# EAGLE design GONAKED (EAGLE 5.11)
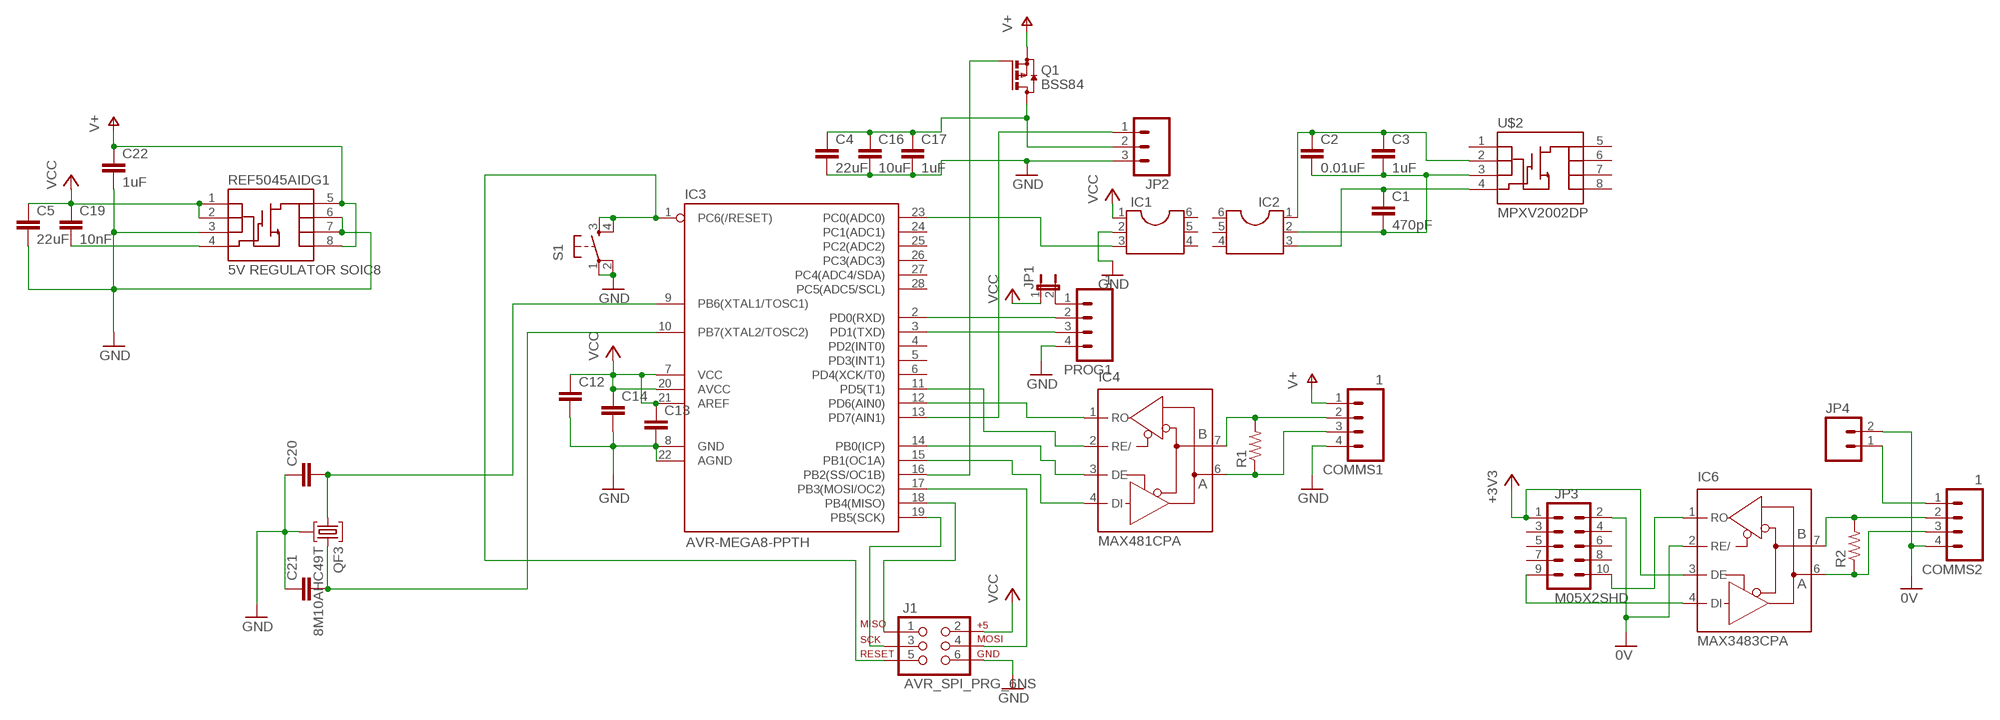
[diagram p0: schematic, sheet 1]

## Parts
C1  470pF  CAP0805  [0805]
C2  0.01uF  CAP0805  [0805]
C3  1uF  CAP0805  [0805]
C4  22uF  CAP1210  [1210]
C5  22uF  CAP1210  [1210]
C12  CAP0805  [0805]
C13  CAP0805  [0805]
C14  CAP0805  [0805]
C16  10uF  CAP0805  [0805]
C17  1uF  CAP0805  [0805]
C19  10nF  CAP0805  [0805]
C20  CAP0805  [0805]
C21  CAP0805  [0805]
C22  1uF  CAP0805  [0805]
COMMS1  1  M04POLAR  [MOLEX-1X4]
COMMS2  1  M04POLAR  [MOLEX-1X4]
IC1  DIL6  [DIL06]
IC2  DIL6  [DIL06]
IC3  AVR-MEGA8-PPTH  [DIL28-3]
IC4  MAX481CPA  [DIL08]
IC6  MAX3483CPA  [DIL08]
J1  AVR_SPI_PRG_6NS  [2X3-NS]
JP1  JUMPER-2PTH  [1X02]
JP2  M03POLAR  [MOLEX-1X3]
JP3  M05X2SHD  [2X5-SHROUDED]
JP4  M02LOCK_LONGPADS  [1X02_LOCK_LONGPADS]
PROG1  1  M04POLAR  [MOLEX-1X4]
Q1  BSS84  [SOT23]
QF3  8M10AHC49T  [HC49U]
R1  RESISTOR0805-RES  [0805]
R2  RESISTOR0805-RES  [0805]
REF5045AIDG1  5V REGULATOR SOIC8  MOSFET-NCHANNEL-SOIC8  [SO08]
S1  TAC_SWITCHPTH  [TACTILE-PTH]
U$2  MPXV2002DP  MOSFET-NCHANNEL-SOIC8  [SO08]

## Nets
0V: COMMS2.4 IC6.2(RE/) JP3.2 JP4.2
+3V3: IC6.3(DE) JP3.1
GND: C4.2 C5.2 C12.2 C13.2 C14.2 C16.2 C17.2 C20.1 C21.1 C22.2 COMMS1.4 IC1.2 IC3.8(GND) IC3.22(AGND) J1.6 JP2.3 PROG1.4 QF3.2 REF5045AIDG1.3(S) REF5045AIDG1.6(D) REF5045AIDG1.7(D) S1.1 S1.2
N$1: C4.1 C16.1 C17.1 JP2.2 Q1.3(D)
N$2: IC3.19(PB5(SCK)) J1.3
N$3: IC3.1(PC6(/RESET)) J1.5 S1.3 S1.4
N$4: IC1.3 IC3.23(PC0(ADC0))
N$5: IC3.18(PB4(MISO)) J1.1
N$6: IC3.17(PB3(MOSI/OC2)) J1.4
N$7: IC3.13(PD7(AIN1)) JP2.1
N$8: COMMS1.2 IC4.7(B) R1.2
N$9: COMMS1.3 IC4.6(A) R1.1
N$10: IC3.2(PD0(RXD)) PROG1.2
N$11: IC3.3(PD1(TXD)) PROG1.3
N$12: IC3.12(PD6(AIN0)) IC4.1(RO)
N$13: IC3.11(PD5(T1)) IC4.2(RE/)
N$14: IC3.14(PB0(ICP)) IC4.3(DE)
N$15: IC3.15(PB1(OC1A)) IC4.4(DI)
N$16: JP1.2 PROG1.1
N$17: C20.2 IC3.9(PB6(XTAL1/TOSC1)) QF3.1
N$18: C21.2 IC3.10(PB7(XTAL2/TOSC2)) QF3.3
N$19: IC3.16(PB2(SS/OC1B)) Q1.1(G)
N$20: COMMS2.2 IC6.7(B) R2.2
N$21: COMMS2.3 IC6.6(A) R2.1
N$23: C19.2 REF5045AIDG1.4(G)
N$24: IC6.1(RO) JP3.10
N$25: IC6.4(DI) JP3.9
N$27: COMMS2.1 JP4.1
N$31: C1.1 IC2.3 U$2.4(G)
N$32: C2.1 C3.1 IC2.1 U$2.2(S)
N$34: C1.2 C2.2 C3.2 IC2.2 U$2.3(S)
V+: C22.1 COMMS1.1 Q1.2(S) REF5045AIDG1.5(D) REF5045AIDG1.8(D)
VCC: C5.1 C12.1 C13.1 C14.1 C19.1 IC1.1 IC3.7(VCC) IC3.20(AVCC) IC3.21(AREF) J1.2 JP1.1 REF5045AIDG1.1(S) REF5045AIDG1.2(S)
Unconnected: IC1.4 IC1.5 IC1.6 IC2.4 IC2.5 IC2.6 IC3.4(PD2(INT0)) IC3.5(PD3(INT1)) IC3.6(PD4(XCK/T0)) IC3.24(PC1(ADC1)) IC3.25(PC2(ADC2)) IC3.26(PC3(ADC3)) IC3.27(PC4(ADC4/SDA)) IC3.28(PC5(ADC5/SCL)) JP3.3 JP3.4 JP3.5 JP3.6 JP3.7 JP3.8 U$2.1(S) U$2.5(D) U$2.6(D) U$2.7(D) U$2.8(D)

## Power pins joined to a net without a drawn wire
0V: IC6.5(0V)
+3V3: IC6.8(+3V3)
GND: IC4.5(GND)
VCC: IC4.8(VCC)

## Library data of the parts
C1-C5 C12-C14 C16 C17 C19-C22 = SparkFun:CAP: Capacitor Standard 0603 ceramic capacitor, and 0.1" leaded capacitor.
COMMS1 COMMS2 PROG1 = SparkFun:M04: Header 4 Standard 4-pin 0.1" header. Use with straight break away headers (SKU : PRT-00116), right angle break away headers (PRT-00553), swiss pins (PRT-00743), machine pins (PRT-00117), and female headers (PRT-00115). Molex polarized connector foot print use with SKU : PRT-08231 with associated crimp pins and housings. 1MM SMD Version SKU: PRT-10208
IC1 IC2 = ic-package:DIL6: Dual In Line / Socket
IC3 = SparkFun:AVR-MEGA8-P: MICROCONTROLLER 8 Kbytes FLASH 1 kbytes SRAM 512 bytes EEPROM USART 4-channel 10 bit ADC 2-channel 8 bit ADC
IC4 = maxim:MAX481CPA: RS485 TRANSEIVER; MPN: MAX481CPA+; OC_FARNELL: unknown; OC_NEWARK: 99K3445
IC6 = maxim-10:MAX3483CPA: RS485 TRANSEIVER
J1 = SparkFun:AVR_SPI_PRG_6: AVR ISP 6 Pin This is the reduced ISP connector for AVR programming. Common on Arduino. This footprint will take up less PCB space and can be used with a 10-pin to 6-pin adapter such as SKU: BOB-08508
JP1 = SparkFun:JUMPER-2: Jumper Basic 0.1" spaced jumper. Use with breakaway headers.
JP2 = SparkFun:M03: Header 3 Standard 3-pin 0.1" header. Use with straight break away headers (SKU : PRT-00116), right angle break away headers (PRT-00553), swiss pins (PRT-00743), machine pins (PRT-00117), and female headers (PRT-00115). Molex polarized connector foot print use with SKU : PRT-08232 with associated crimp pins and housings.
JP3 = SparkFun:M05X2: Header 5x2 Standard 10-pin dual row 0.1" header. Commonly used with AVR-ISP. Use with Spark Fun Electronics SKU: PRT-00778
JP4 = SparkFun:M02: Header 2 Standard 2-pin 0.1" header. Use with straight break away headers (SKU : PRT-00116), right angle break away headers (PRT-00553), swiss pins (PRT-00743), machine pins (PRT-00117), and female headers (PRT-00115). Molex polarized connector foot print use with SKU : PRT-08233 with associated crimp pins and housings.
Q1 = transistor-small-signal:BSS84: P-CHANNEL MOS FET
QF3 = crystal:8M10AHC49T: Monolithic Crystal Filters Source: www.vanlong.com; OC_FARNELL: unknown; OC_NEWARK: unknown
R1 R2 = SparkFun:RESISTOR: Resistor Basic schematic elements and footprints for 0603, 1206, and PTH resistors.
REF5045AIDG1 U$2 = SparkFun:MOSFET-NCHANNEL-SOIC8: N-Channel MOSFET IRF9410 and NDS8434 are common, SOIC-8 parts.
S1 = SparkFun:TAC_SWITCH: Momentary Switch Button commonly used for reset or general input. Spark Fun Electronics SKU : COM-00097

## Board
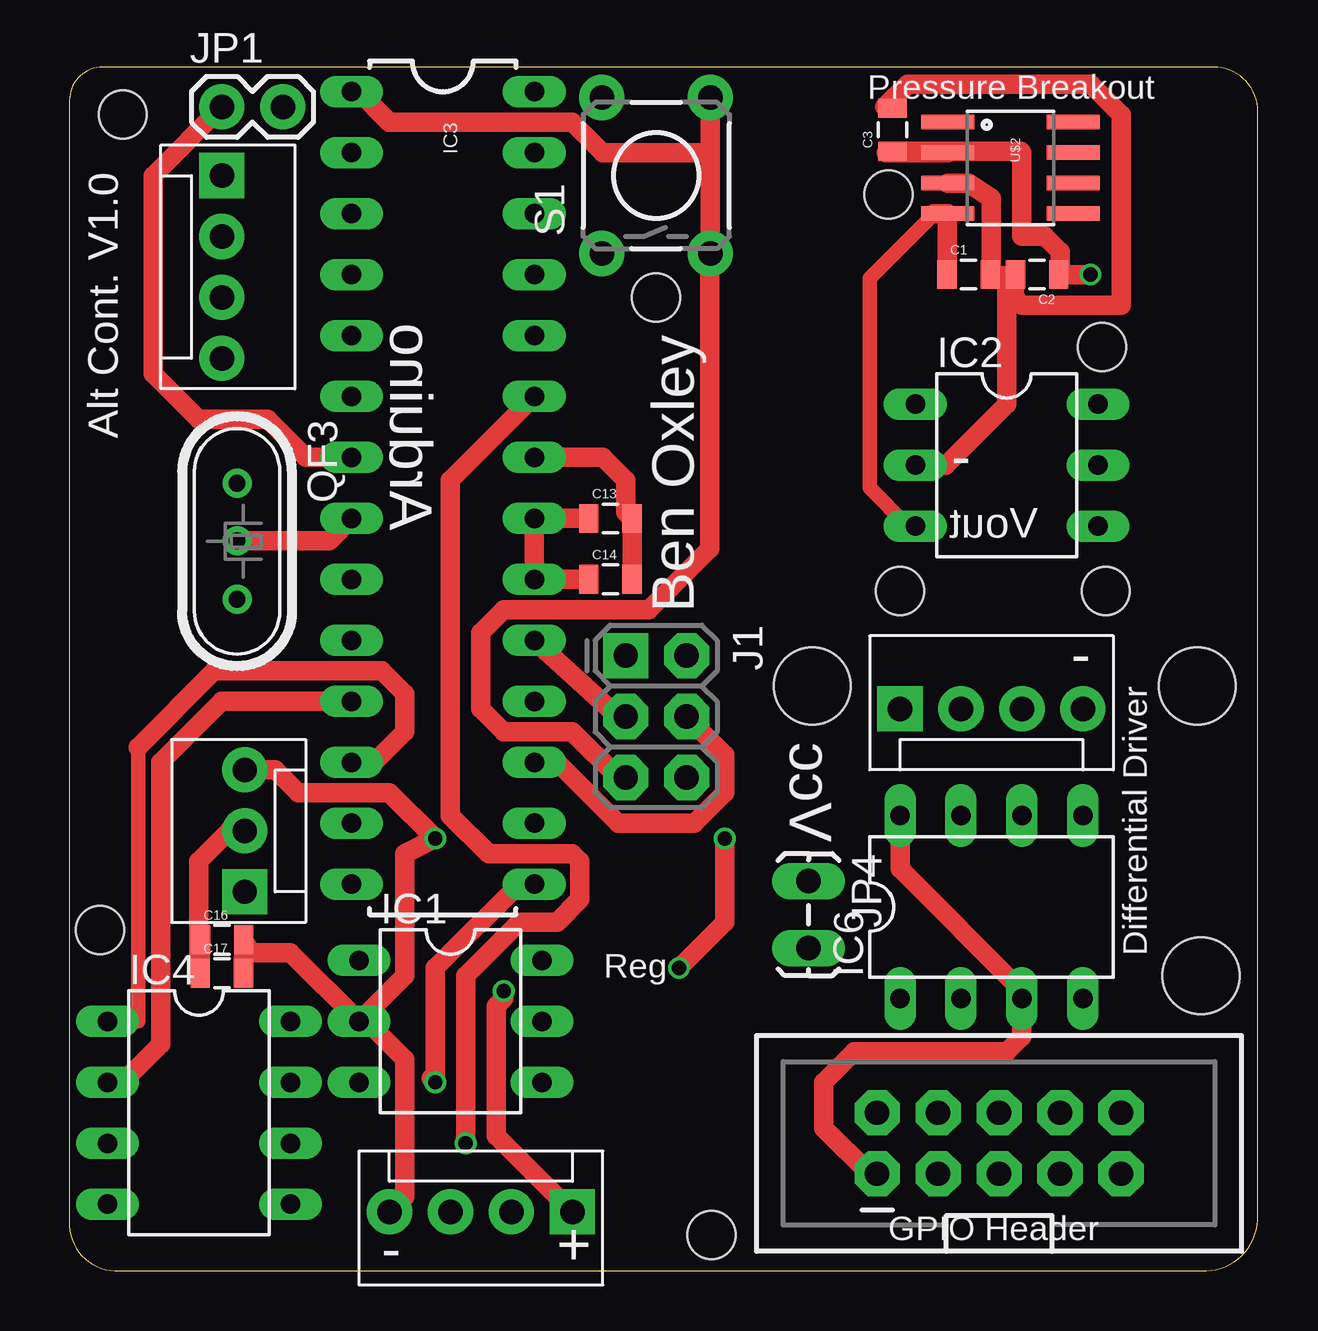
[diagram p1: board, top side]
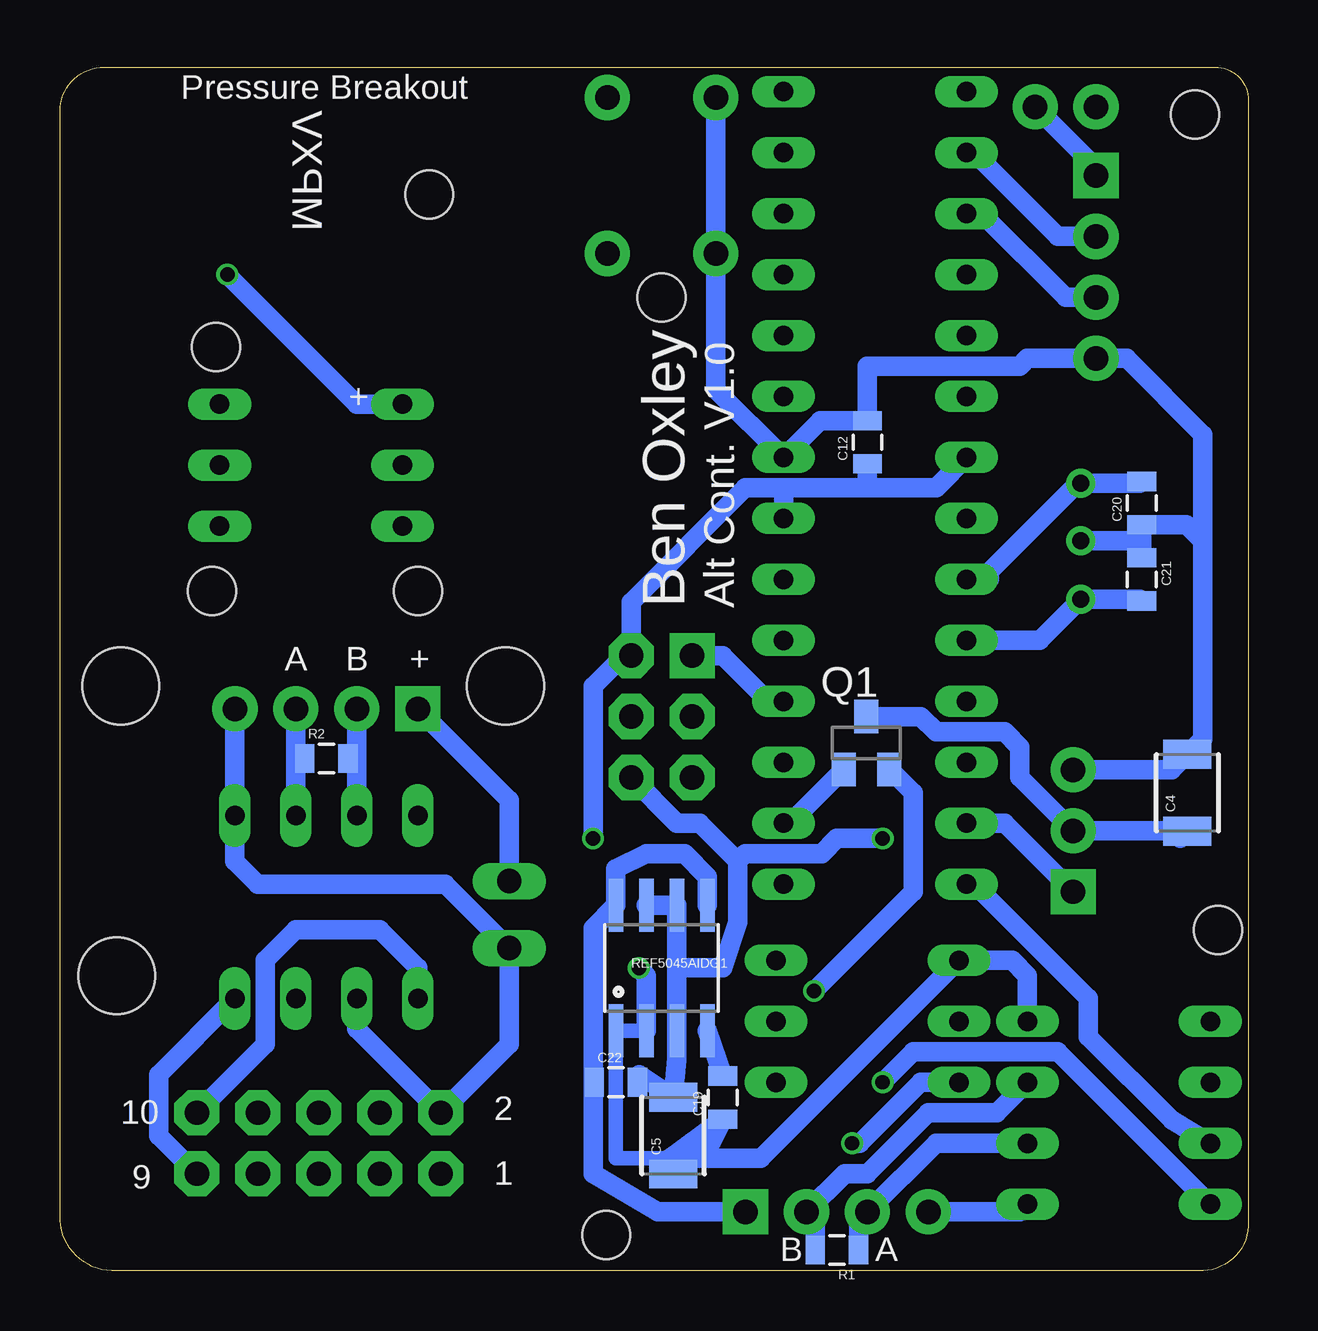
[diagram p2: board, bottom side, seen from below]

Size 49.52 x 50.16 mm. Coordinates in mm from the lower left corner, seen from the top.
Outline: 1.38,50.16 arc90 0,48.78 0,2.05 arc90 1.89,0 47.36,0 arc90 49.52,2.31 49.52,48.32 arc90 47.68,50.16 1.38,50.16
Copper layers (1*16): Top 0.035mm / dielectric 1.5mm / Bottom 0.035mm
Design rules "Fusion_eagle_rule_v1.1": minimum track width 6mil, minimum drill 12mil, track to track 6mil, track to pad 6mil, pad to pad 6mil, via to via 6mil, smd to smd 0mil, copper to edge 10mil, drill to drill 10mil, minimum pad ring 10mil, minimum via ring 6mil, stop-mask expansion 2mil, vias tented up to drill 100mil, thermal gap 10mil
Holes 2 mm at 26.76,1.49 2.22,48.18 24.45,40.56 1.27,14.21 34.61,28.33 43.18,28.33 34.13,44.84 43.02,38.49
Holes 3.2 mm at 30.96,24.37 46.99,24.37 47.15,12.3

### Footprints (pad centres in the part's own frame; a part is rotated, then mirrored left to right if it is on the bottom)
0805 = smd 0.8 x 1.2: 1 -0.9,0; 2 0.9,0
1210 = smd 1.2 x 2: 1 -1.6,0; 2 1.6,0
MOLEX-1X4 = drill 1.016 pad 1.88 square: 1 0,0 | drill 1.016 pad 1.88 round: 2 2.54,0; 3 5.08,0; 4 7.62,0
DIL06 = drill 0.813 long: 1 -2.54,-3.81; 2 0,-3.81; 3 2.54,-3.81; 4 2.54,3.81; 5 0,3.81; 6 -2.54,3.81
DIL28-3 = drill 0.813 long: 1 -16.51,-3.81; 2 -13.97,-3.81; 3 -11.43,-3.81; 4 -8.89,-3.81; 5 -6.35,-3.81; 6 -3.81,-3.81; 7 -1.27,-3.81; 8 1.27,-3.81; 9 3.81,-3.81; 10 6.35,-3.81; 11 8.89,-3.81; 12 11.43,-3.81; 13 13.97,-3.81; 14 16.51,-3.81; 15 16.51,3.81; 16 13.97,3.81; 17 11.43,3.81; 18 8.89,3.81; 19 6.35,3.81; 20 3.81,3.81; 21 1.27,3.81; 22 -1.27,3.81; 23 -3.81,3.81; 24 -6.35,3.81; 25 -8.89,3.81; 26 -11.43,3.81; 27 -13.97,3.81; 28 -16.51,3.81
DIL08 = drill 0.813 long: 1 -3.81,-3.81; 2 -1.27,-3.81; 3 1.27,-3.81; 4 3.81,-3.81; 5 3.81,3.81; 6 1.27,3.81; 7 -1.27,3.81; 8 -3.81,3.81
2X3-NS = drill 1.016 pad 1.88 square: 1 -2.54,-1.27 | drill 1.016 pad 1.88 octagon: 2 -2.54,1.27; 3 0,-1.27; 4 0,1.27; 5 2.54,-1.27; 6 2.54,1.27
1X02 = drill 1.016 pad 1.88 round: 1 0,0; 2 2.54,0
MOLEX-1X3 = drill 1.016 pad 1.88 square: 1 0,0 | drill 1.016 pad 1.88 round: 2 2.54,0; 3 5.08,0
2X5-SHROUDED = drill 1.016 pad 1.88 octagon: 1 -1.27,5.08; 2 1.27,5.08; 3 -1.27,2.54; 4 1.27,2.54; 5 -1.27,0; 6 1.27,0; 7 -1.27,-2.54; 8 1.27,-2.54; 9 -1.27,-5.08; 10 1.27,-5.08
1X02_LOCK_LONGPADS = drill 1.016 long: 1 -0.127,0; 2 2.667,0
SOT23 = smd 1 x 1.4: 1 -0.95,-1.1; 2 0.95,-1.1; 3 0,1.1
HC49U = drill 0.7 pad 1.2 round: 1 -2.413,0; 2 -0.027,0; 3 2.413,0
SO08 = smd 0.61 x 2.21: 1 -1.905,-2.616; 2 -0.635,-2.616; 3 0.635,-2.616; 4 1.905,-2.616; 5 1.905,2.616; 6 0.635,2.616; 7 -0.635,2.616; 8 -1.905,2.616
TACTILE-PTH = drill 1.016 pad 1.88 round: 1 -3.251,2.261; 2 3.251,2.261; 3 -3.251,-2.261; 4 3.251,-2.261

### Placement (x,y rotation side)
C1  37.47,41.51 0 top
C2  40.32,41.51 180 top
C3  34.29,47.54 90 top
C4  2.54,19.92 90 bottom
C5  23.97,5.63 90 bottom
C12  15.87,34.53 90 bottom
C13  22.54,31.35 0 top
C14  22.54,28.81 0 top
C16  6.36,13.79 0 top
C17  6.35,12.4 0 top
C19  21.91,7.22 90 bottom
C20  4.45,31.99 90 bottom
C21  4.45,28.81 270 bottom
C22  26.35,7.86 0 bottom
COMMS1  20.95,2.46 180 top
COMMS2  34.61,23.41 0 top
IC1  15.87,10.4 270 top
IC2  39.05,33.57 270 top
IC3  15.56,32.62 270 top
IC4  5.4,6.59 270 top
IC6  38.42,15.16 0 top
J1  24.45,23.1 270 top
JP1  6.35,48.5 0 top
JP2  7.3,15.79 90 top
JP3  38.73,5.32 90 top
JP4  30.8,16.11 270 top
PROG1  6.35,45.64 270 top
Q1  15.92,22 0 bottom
QF3  6.98,30.4 270 top
R1  17.15,0.87 180 bottom
R2  38.42,21.35 0 bottom
REF5045AIDG1  24.45,12.62 0 bottom
S1  24.45,45.64 90 top
U$2  39.21,45.96 270 top

### Tracks (layer width: path | path; a pad name or v marks a point on that pad's centre or on a via)
0V
  Bottom 0.813: COMMS2.4 IC6.5 42.23,17.06 41.27,16.11 33.46,16.11 JP4.2 30.8,9.44 JP3.2 37.15,10.08 IC6.2
+3V3
  Top 0.813: JP3.1 33.34,4.05 31.43,5.95 31.43,7.86 32.7,9.13 39.05,9.13 39.69,9.76 IC6.3 39.69,11.67 34.61,16.75 IC6.8
GND  (via drill 0.6)
  Top 0.813: QF3.2 10.82,30.42 IC3.8 | JP2.3 8.57,20.87 9.53,19.92 13.33,19.92 v15.24,18.02 13.97,17.38 13.97,12.3 IC1.2 | IC1.2 12.38,10.4 13.97,8.81 13.97,3.09 COMMS1.4 | C14.2 C13.2 23.18,31.62 23.18,32.94 22.23,33.89 IC3.22 | C17.2 C16.2 7.57,13.25 9.21,13.25 IC1.2
  Bottom 0.813: 23.81,12.62 REF5045AIDG1.3 23.81,8.82 C5.2 25.39,8.17 C22.2 | 23.81,15.16 REF5045AIDG1.6 REF5045AIDG1.7 23.89,15.23 23.81,15.16 | COMMS1.4 9.53,2.46 IC4.5 | 4.47,30.42 QF3.2 | 4.47,30.42 4.45,30.4 C21.1 | 4.47,30.42 4.45,30.45 C20.1 2.59,31.09 1.91,30.4 | 1.91,30.4 1.91,22.16 C4.2 3.19,20.87 JP2.3 | 1.91,30.4 1.91,34.84 5.08,38.02 PROG1.4 9.21,38.02 9.53,37.7 15.87,37.7 C12.2 17.83,35.43 IC3.22 22.19,36.71 S1.1 S1.2 | 23.81,12.62 23.81,15.16 | 23.81,12.62 21.91,12.62 21.27,14.52 21.27,17.06 | 21.27,17.06 22.86,18.65 23.81,18.65 J1.6 | v15.24,18.02 17.15,18.02 17.78,17.38 20.95,17.38 21.27,17.06
N$1
  Top 0.813: C17.1 C16.1 5.4,12.99 5.4,17.06 6.67,18.33 JP2.2
  Bottom 0.813: 2.84,18.02 C4.1 2.55,18.33 JP2.2 9.53,20.56 9.53,21.83 10.16,22.46 13.02,22.46 13.65,23.1 Q1.3
N$2
  Top 0.813: IC3.19 22.86,23.1 J1.3
N$3
  Top 0.813: J1.5 22.86,20.56 20.95,22.46 18.1,22.46 17.15,23.41 17.15,26.59 18.1,27.54 24.13,27.54 26.67,30.08 26.67,42.35 S1.3 26.71,46.59 | 26.71,46.59 S1.4 | IC3.1 12.06,49.13 13.33,47.86 20.95,47.86 22.23,46.59 26.71,46.59
N$4  (via drill 0.6)
  Top 0.813: v16.51,5.32 16.51,12.3 18.73,14.52 20.32,14.52 21.27,15.48 21.27,17.06 20.95,17.38 17.46,17.38 15.87,18.97 15.87,32.94 IC3.23
  Bottom 0.813: IC1.3 13.65,7.86 16.19,5.32 v16.51,5.32
N$5
  Bottom 0.813: J1.1 21.91,25.64 20,23.73 IC3.18
N$6
  Top 0.813: IC3.17 20.32,21.19 22.86,18.65 26.03,18.65 27.3,19.92 27.3,21.51 J1.4
N$7
  Bottom 0.813: IC3.13 10.16,18.65 JP2.1
N$8
  Bottom 0.813: IC4.7 10.48,6.59 13.33,6.59 15.87,4.05 16.83,4.05 COMMS1.2 18.05,2.46 R1.2
N$9
  Bottom 0.813: IC4.6 13.02,5.32 COMMS1.3 16.24,2.46 R1.1
N$10
  Bottom 0.813: IC3.2 11.43,46.59 7.94,43.1 PROG1.2
N$11
  Bottom 0.813: IC3.3 11.11,44.05 7.62,40.56 PROG1.3
N$12
  Top 0.61: IC4.1 2.86,10.4 2.86,21.83
  Top 0.813: 2.86,21.83 6.03,25 13.02,25 13.97,24.05 13.97,22.46 12.7,21.19 IC3.12
N$13
  Top 0.813: IC4.2 2.22,7.86 3.81,9.44 3.81,21.19 6.35,23.73 IC3.11
N$14
  Bottom 0.813: IC3.14 11.43,16.11 6.67,11.35 6.67,9.76 3.18,6.27 IC4.3
N$15  (via drill 0.6)
  Top 0.813: IC3.15 18.73,16.11 15.24,12.62 15.24,8.17 15.08,8.01 v15.24,7.86
  Bottom 0.813: IC4.4 7.94,9.13 13.97,9.13 v15.24,7.86
N$16
  Bottom 0.813: PROG1.1 6.35,45.96 JP1.2
N$17
  Bottom 0.813: C20.2 4.52,32.81 QF3.1 7.11,32.81 10.79,29.13 10.79,28.81 IC3.9
N$18
  Bottom 0.813: IC3.10 8.7,26.27 QF3.3 4.52,27.98 C21.2
N$19
  Bottom 0.813: IC3.16 19.12,18.65 Q1.1
N$20
  Bottom 0.813: IC6.7 37.15,21.35 | 37.15,21.35 COMMS2.2 | 37.15,21.35 R2.2 | 37.15,21.35
N$21
  Bottom 0.813: IC6.6 39.69,21.35 | 39.69,21.35 COMMS2.3 | 39.69,21.35 R2.1 | 39.69,21.35
N$23
  Bottom 0.813: C19.2 REF5045AIDG1.4
N$24
  Bottom 0.813: IC6.1 34.61,12.62 36.2,14.21 39.69,14.21 40.96,12.94 40.96,9.44 JP3.10
N$25
  Bottom 0.813: JP3.9 45.4,5.63 45.4,8.17 IC6.4
N$27
  Bottom 0.813: JP4.1 30.8,19.6 COMMS2.1
N$31
  Top 0.61: 34.93,31.03 33.34,32.62 33.34,41.35 36.04,44.05
  Top 0.813: IC2.3 34.93,31.03 | 36.04,44.05 U$2.4 36.57,43.92 C1.1
N$32  (via drill 0.6)
  Top 0.813: U$2.2 34.02,46.59 C3.1 39.64,46.64 39.69,46.59 39.69,43.1 40.64,43.1 41.27,42.46 41.27,41.56 C2.1 v42.55,41.51
  Bottom 0.813: IC2.1 37.15,36.11 v42.55,41.51
N$34
  Top 0.813: C3.2 33.97,48.5 34.93,49.45 42.55,49.45 43.82,48.18 43.82,40.24 39.69,40.24 39.37,40.56 39.37,41.46 | 39.37,41.46 C2.2 39.05,41.14 39.05,36.11 36.51,33.57 IC2.2 | 39.37,41.46 38.42,41.46 C1.2 38.42,41.56 38.42,44.69 37.47,45.32 U$2.3
V+  (via drill 0.6)
  Top 0.813: v18.1,11.67 18.1,11.35 17.78,11.03 17.78,5.63 COMMS1.1
  Bottom 0.813: COMMS1.1 24.61,2.46 27.3,4.05 27.3,8.17 | 27.3,8.17 27.3,14.28 REF5045AIDG1.8 26.35,16.75 25.08,17.38 23.49,17.38 22.54,16.43 REF5045AIDG1.5 | 27.3,8.17 C22.1 | Q1.2 14.94,20.9 13.97,19.92 13.97,15.79 v18.1,11.67
VCC  (via drill 0.6)
  Top 0.813: JP1.1 3.49,45.64 3.49,37.38 5.4,35.48 8.26,35.48 9.84,33.89 IC3.7 | v27.3,18.02 27.3,14.52 v25.4,12.62 | C13.1 IC3.21 IC3.20 C14.1
  Bottom 0.61: REF5045AIDG1.2 REF5045AIDG1.1 26.35,4.68 24.12,4.68
  Bottom 0.813: 15.87,32.62 13.02,32.62 IC3.7 | 19.37,32.62 15.87,32.62 | IC4.8 9.21,12.3 9.84,12.94 IC1.1 20.32,4.68 22.54,4.68 | 15.87,32.62 C12.1 | 24.12,4.68 22.54,5 | 22.54,5 22.54,4.68 | 24.12,4.68 21.96,6.27 C19.1 22.54,5 | 24.12,4.68 C5.1 | 24.12,4.68 22.54,4.68 | v27.3,18.02 27.3,24.37 26.03,25.64 J1.2 25.72,27.86 20.95,32.62 19.37,32.62 | REF5045AIDG1.2 25.08,12.3 v25.4,12.62 | 19.37,32.62 IC3.21

### Text on the board
_tsilk: Pressure Breakout | Arduino | Alt Cont. V1.0 | - | Vout | Ben Oxley | - | Vcc | Differential Driver | Reg | GPIO Header | - | +
_bsilk: Pressure Breakout | MPXV | + | Alt Cont. V1.0 | Ben Oxley | + | B | A | 2 | 10 | 1 | 9 | A | B